# Altium schematic sheet Overview.SchDoc
size A4; Organization: Altium Limited; Address1: L3, 12a Rodborough Rd; Address2: Frenchs Forest; Address3: NSW; Address4: Australia 2086
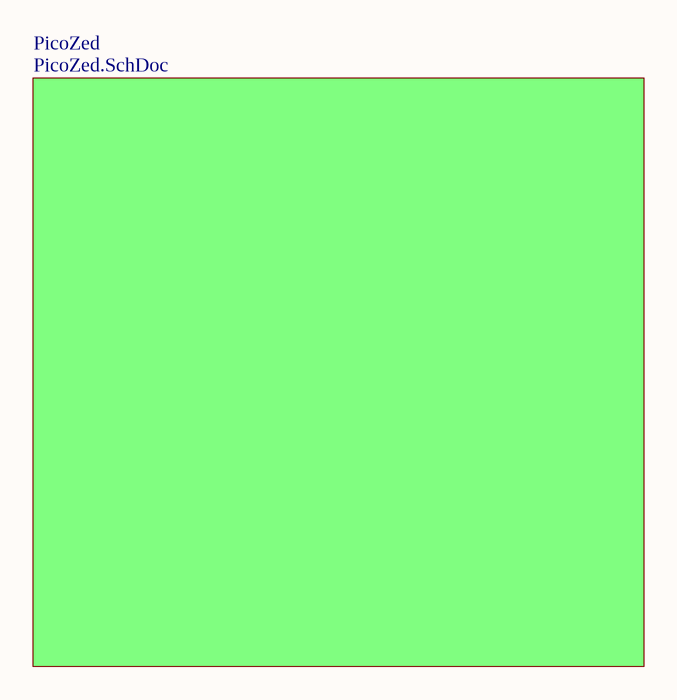
[diagram p0: Overview.SchDoc]

## Sub-sheets
PicoZed = PicoZed.SchDoc: no entries

## Notes on the sheet
- Title
- Size:
- Date:
- A2
- Project ID:
- Time:
- Sheet
- Version:
- of
- Variant:
- File: